# Altium schematic sheet ECU_AutoRC_BLE_r00.SchDoc
size A4; SheetNumber: 6; SheetTotal: 9
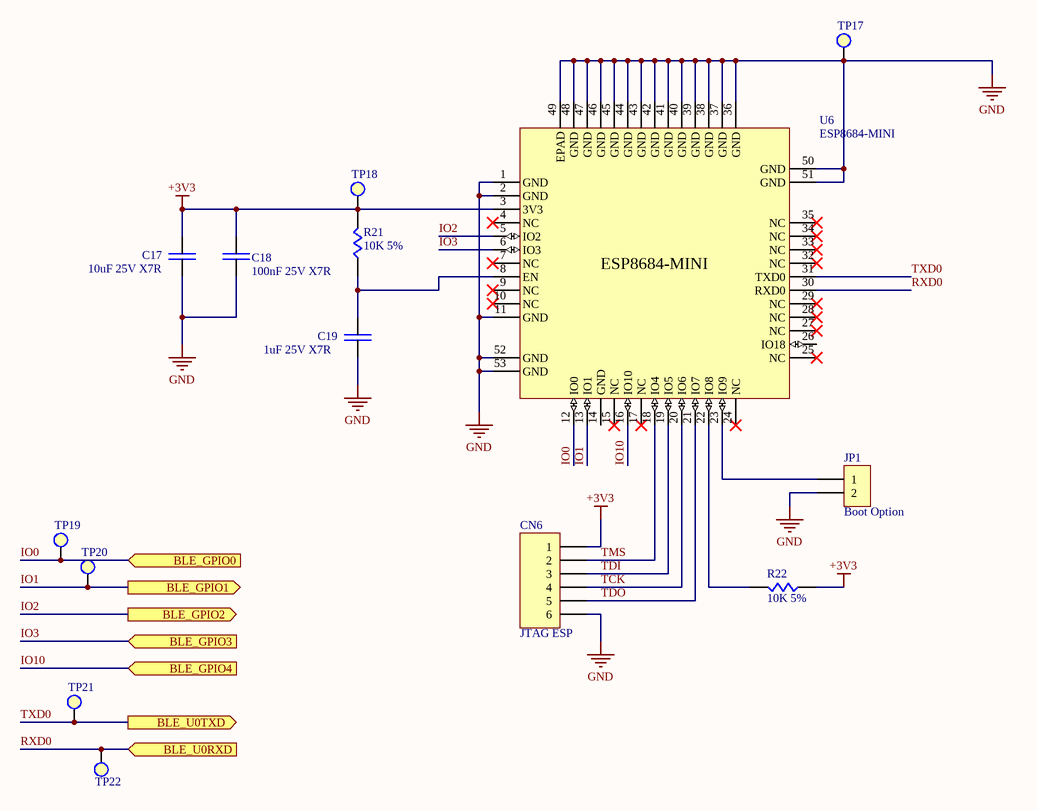
[diagram p0: ECU_AutoRC_BLE_r00.SchDoc]

## Parts
C17  10uF 25V X7R  [C_0805]
C18  100nF 25V X7R  [C_0805]
C19  1uF 25V X7R  [C_0805]
CN6  JTAG ESP  [HEADER_2x3_2.5MM]
JP1  Boot Option  [Header_M_1x2_0.1"]
R21  10K 5%  [R_0805]
R22  10K 5%  [R_0805]
TP17  Test Point  [TEST_POINT]  (value not drawn)
TP18  Test Point  [TEST_POINT]  (value not drawn)
TP19  Test Point  [TEST_POINT]  (value not drawn)
TP20  Test Point  [TEST_POINT]  (value not drawn)
TP21  Test Point  [TEST_POINT]  (value not drawn)
TP22  Test Point  [TEST_POINT]  (value not drawn)
U6  ESP8684-MINI  [ESP8684-MINI]

## Ports
BLE_GPIO0 (in, see ECU_AutoRC_BLK_r00[2C], ECU_AutoRC_UC1_r00[1A]), BLE_GPIO1 (out, see ECU_AutoRC_BLK_r00[2C], ECU_AutoRC_UC1_r00[1A]), BLE_GPIO2 (out, see ECU_AutoRC_BLK_r00[2C], ECU_AutoRC_UC1_r00[1B]), BLE_GPIO3 (in, see ECU_AutoRC_BLK_r00[2C], ECU_AutoRC_UC1_r00[1B]), BLE_GPIO4 (in, see ECU_AutoRC_BLK_r00[2C], ECU_AutoRC_UC1_r00[1B]), BLE_U0RXD (in, see ECU_AutoRC_BLK_r00[2C], ECU_AutoRC_UC1_r00[3B]), BLE_U0TXD (out, see ECU_AutoRC_BLK_r00[2C], ECU_AutoRC_UC1_r00[3B])

## Nets
+3V3: C17.1 C18.1 CN6.1 R21.2 R22.1 TP18.1 U6.3(3V3)
GND: C17.2 C18.2 C19.2 CN6.6 JP1.2 TP17.1 U6.1(GND) U6.2(GND) U6.11(GND) U6.36(GND) U6.37(GND) U6.38(GND) U6.39(GND) U6.40(GND) U6.41(GND) U6.42(GND) U6.43(GND) U6.44(GND) U6.45(GND) U6.46(GND) U6.47(GND) U6.48(GND) U6.49(EPAD) U6.50(GND) U6.51(GND) U6.52(GND) U6.53(GND)
IO0: TP19.1 U6.12(IO0) ; port BLE_GPIO0
IO1: TP20.1 U6.13(IO1) ; port BLE_GPIO1
IO2: U6.5(IO2) ; port BLE_GPIO2
IO3: U6.6(IO3) ; port BLE_GPIO3
IO10: U6.16(IO10) ; port BLE_GPIO4
RXD0: TP22.1 U6.30(RXD0) ; port BLE_U0RXD
TCK: CN6.4 U6.20(IO6)
TDI: CN6.3 U6.19(IO5)
TDO: CN6.5 U6.21(IO7)
TMS: CN6.2 U6.18(IO4)
TXD0: TP21.1 U6.31(TXD0) ; port BLE_U0TXD
NetC19_1: C19.1 R21.1 U6.8(EN)
NetJP1_1: JP1.1 U6.23(IO9)
NetR22_2: R22.2 U6.22(IO8)

Not connected (* = marked no-connect by the designer): U6 4(NC)* 7(NC)* 9(NC)* 10(NC)* 14(GND) 15(NC)* 17(NC)* 24(NC)* 25(NC)* 26(IO18) 27(NC)* 28(NC)* 29(NC)* 32(NC)* 33(NC)* 34(NC)* 35(NC)*

## Library data of the parts
C17-C19 = Capacitor NP: Non Polarizated Capacitor
CN6 = CONN_06P: Connector Generic 6 Vias
JP1 = Jumper
R21 R22 = Resistor
TP17-TP22 = TestPoint